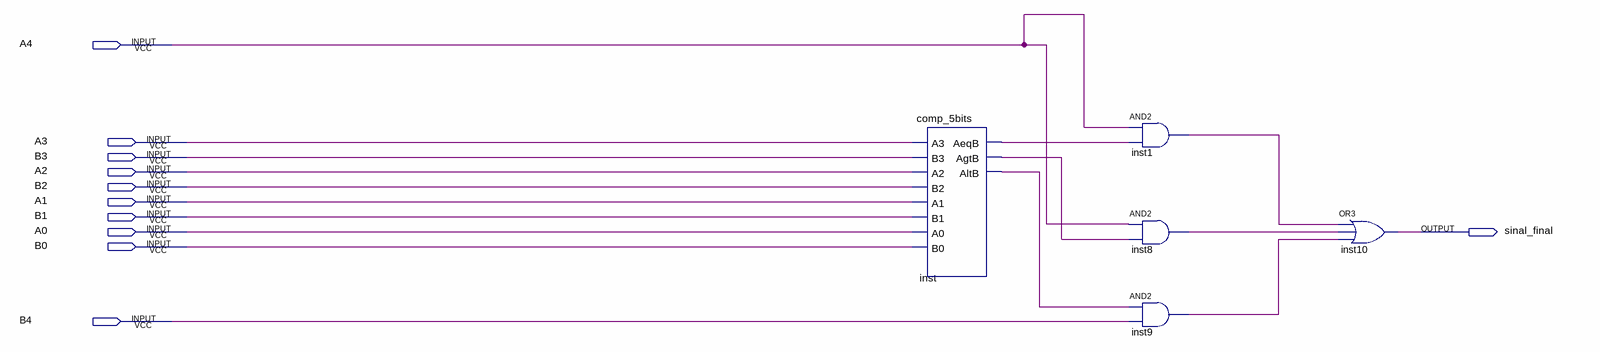
[diagram p0: schematic sheet]
// Quartus schematic comp_magnitude.bdf as structural Verilog: 5 symbols, 11 pins
module comp_magnitude (
  input  A4,
  input  A3,
  input  B3,
  input  A2,
  input  B2,
  input  A1,
  input  B1,
  input  A0,
  input  B0,
  input  B4,
  output sinal_final
);

  wire inst1_out, inst8_out, inst9_out, inst_aeqb, inst_agtb, inst_altb;

  comp_5bits inst (
    .A3(A3), .B3(B3), .A2(A2), .B2(B2), .A1(A1), .B1(B1), .A0(A0), .B0(B0), .AeqB(inst_aeqb),
    .AgtB(inst_agtb), .AltB(inst_altb));
  and inst1 (inst1_out, A4, inst_aeqb);
  and inst8 (inst8_out, A4, inst_agtb);
  and inst9 (inst9_out, inst_altb, B4);
  or inst10 (sinal_final, inst1_out, inst8_out, inst9_out);
endmodule
